# Altium schematic sheet Interface.SchDoc
size A4
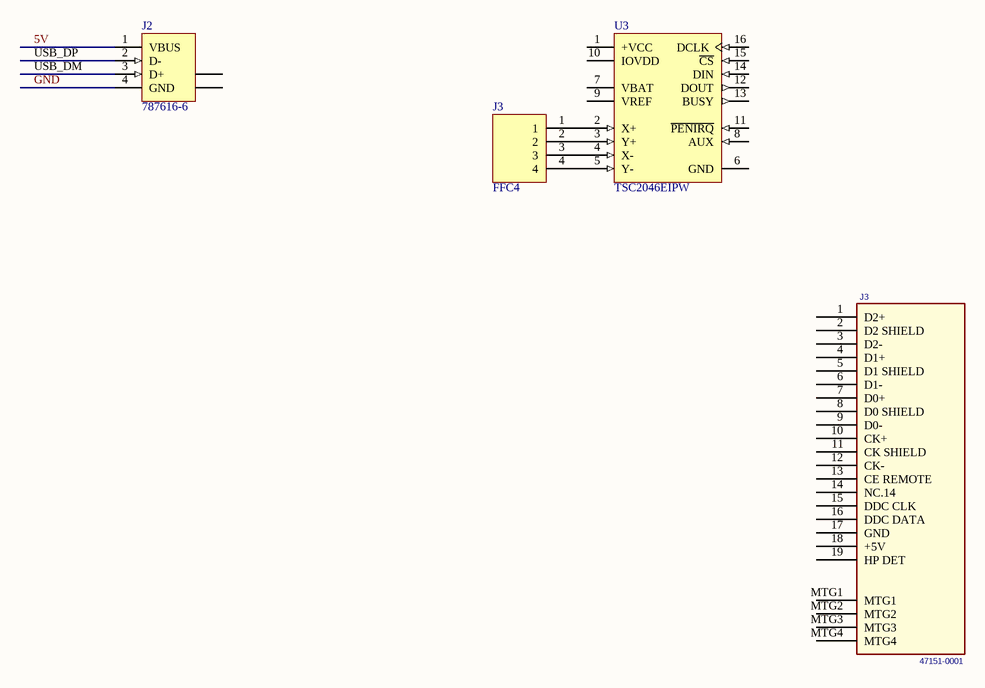
[diagram p0: Interface.SchDoc]

## Parts
(Parts that share a designator on the sheet are numbered #1, #2 ... from top to bottom, then left to right.)
J2  787616-6  [787616]
J3#1  FFC4  [FFC/SM1.0-2H4]
J3#2  47151-0001  [HDMI]
U3  TSC2046EIPW  [PW016]

## Nets
5V: J2.1(VBUS)
GND: J2.4(GND)
USB_DM: J2.3(D+)
USB_DP: J2.2(D-)
NetJ3#1_1: J3#1.1 U3.2(X+)
NetJ3#1_2: J3#1.2 U3.3(Y+)
NetJ3#1_3: J3#1.3 U3.4(X-)
NetJ3#1_4: J3#1.4 U3.5(Y-)

Not connected (* = marked no-connect by the designer): J2 5(SHLD) 6(SHLD); J3#2 1(D2+) 2(D2_SHIELD) 3(D2-) 4(D1+) 5(D1_SHIELD) 6(D1-) 7(D0+) 8(D0_SHIELD) 9(D0-) 10(CK+) 11(CK_SHIELD) 12(CK-) 13(CE_REMOTE) 14(NC.14) 15(DDC_CLK) 16(DDC_DATA) 17(GND) 18(+5V) 19(HP_DET) MTG1 MTG2 MTG3 MTG4; U3 1(+VCC) 6(GND) 7(VBAT) 8(AUX) 9(VREF) 10(IOVDD) 11(~{PENIRQ}) 12(DOUT) 13(BUSY) 14(DIN) 15(~{CS}) 16(DCLK)

## Library data of the parts
J2 = 787616-6: USB 1.1, Right Angle, Thru-Hole, A Type, Receptacle, 4 Position, Black; ContactMaterial: Copper Alloy; ContactPlating: Gold Flash over Palladium Nickel or Gold (30) over Nickel; TerminationLength: 2.29mm [0.090in.]; PCB_Layout: Complies with manufacturer's recommendation.; DrillSize: Corresponds to nominal value.; PanelGround: Without; Published: 15-Jul-2004; DatasheetDocument: 11-Jan-2004; PackageDocument: 11-Jan-2004; PackageReference: 787616; Publisher: Altium Limited; HousingMaterial: Thermoplastic; ComponentLink1Description: Manufacturer Link; ComponentLink1URL: http://www.tycoelectronics.com/; ComponentLink2Description: Packaging Specification; ComponentLink2URL: http://ecommas.tycoelectronics.com/commerce/DocumentDelivery/DDEController?Action=showdoc&DocId=Customer+Drawing%7F787616%7FK%7Fpdf%7FEnglish%7FENG_CD_787616_K.pdf
J3#2 = 47151-0001: CONN RCPT 19POS HDMI RT ANG SMD; Manufacturer: Molex Connector Corporation; .Checked PCB: used; Number of Positions: 19; Pitch: 0.50mm (.020"); Gender: Receptacle; .Checked SCH: used; Category: Connectors, Interconnects; Connector Type: HDMI; Family: USB, IEEE-1394 (Firewire), DVI, HDMI; Manufacturer Part Number: 47151-0001; Operating Temperature: -20°C to +85°C; Price 1k [$]: 1.74610; Supplier: Digikey; Supplier Part Number: WM19086CT-ND; Value: 47151-0001; Supplier 1: Digi-Key; Supplier Part Number 1: WM19086CT-ND; RoHS: RoHS Compliant; Stock 1: 2756; Pricing 1: 1=3.1, 10=2.57, 50=2.1456, 100=1.9034 (USD); Number of Contacts: 19; Specifications: -; Mounting Type: Surface Mount, Right Angle, Horizontal; Features: Detent Lock; Packaging: Cut Tape (CT); Ingress Protection: -; ComponentLink1URL: http://www.molex.com/pdm_docs/sd/471510001_sd.pdf; ComponentLink1Description: http://www.molex.com/pdm_docs/sd/471510001_sd.pdf
U3 = TSC2046EIPW: 4-Wire Touch Screen controller with Low-Voltage I/O Interface, 16-Pin TSSOP; Published: 6-Oct-2005; DatasheetVersion: Jan-2005; PackageVersion: Feb-1999; PackageReference: PW016; Publisher: Altium Limited; PackageDescription: Shrink Small Outline; 16 Leads; Body Width 4.4 mm; Pitch 0.65 mm; ComponentLink1Description: Manufacturer Link; ComponentLink1URL: http://focus.ti.com/docs/prod/folders/print/tsc2046.html; ComponentLink2Description: Datasheet; ComponentLink2URL: http://focus.ti.com/lit/ds/symlink/tcs2046.pdf